# EAGLE schematic motor (EAGLE 6.5.0)
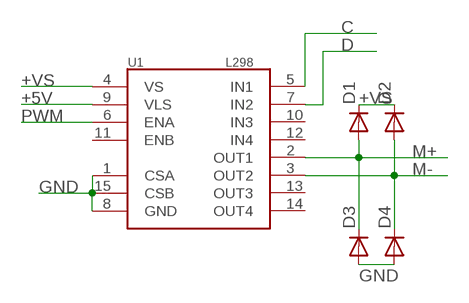
[diagram p0: schematic, sheet 1]

## Parts
D1  DIODEPTH  [DIODE-1N4001]
D2  DIODEPTH  [DIODE-1N4001]
D3  DIODEPTH  [DIODE-1N4001]
D4  DIODEPTH  [DIODE-1N4001]
U1  L298  [MULTIWATT15]

## Nets
+5V: U1.9(VLS)
+VS: D1.C D2.C U1.4(VS)
C: U1.5(IN1)
D: U1.7(IN2)
GND: D3.A D4.A U1.1(CSA) U1.8(GND) U1.15(CSB)
M+: D1.A D3.C U1.2(OUT1)
M-: D2.A D4.C U1.3(OUT2)
PWM: U1.6(ENA)
Unconnected: U1.10(IN3) U1.11(ENB) U1.12(IN4) U1.13(OUT3) U1.14(OUT4)

## Library data of the parts
D1-D4 = SparkFun-DiscreteSemi:DIODE: Diode These are standard reverse protection diodes and small signal diodes. SMA package can handle up to about 1A. SOD-323 can handle about 200mA. What the SOD-323 package when ordering, there are some mfgs out there that are 5-pin packages.
U1 = SparkFun-PowerIC:L298: L298 Dual Full Bridge Driver